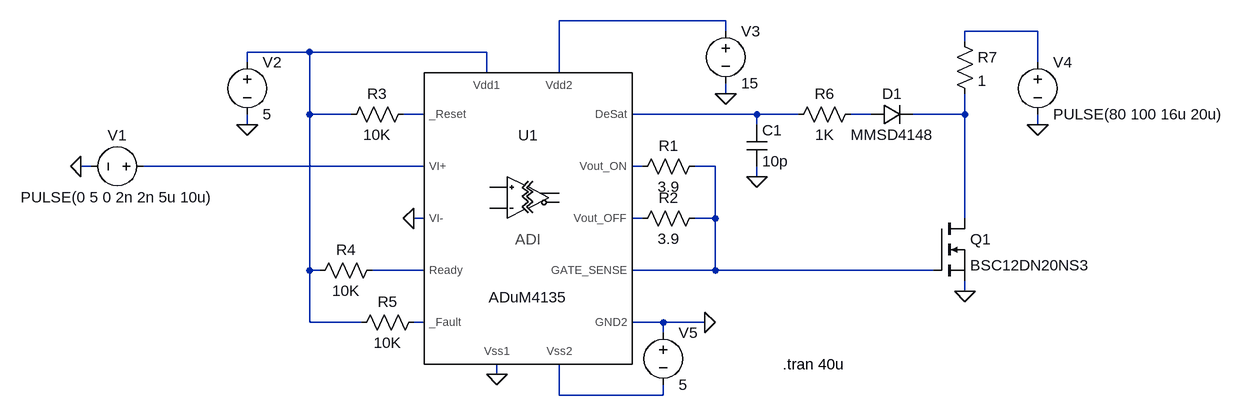
[diagram p0: schematic ADuM4135.asc]
ADuM4135.asc, the LTspice schematic file:
Version 4
SHEET 1 1640 680
WIRE 560 -192 304 -192
WIRE 560 -176 560 -192
WIRE 1040 -176 928 -176
WIRE 928 -160 928 -176
WIRE -80 -144 -176 -144
WIRE 192 -144 -80 -144
WIRE -176 -128 -176 -144
WIRE 1040 -128 1040 -176
WIRE 192 -112 192 -144
WIRE 304 -112 304 -192
WIRE 560 -80 560 -96
WIRE -80 -48 -80 -144
WIRE -16 -48 -80 -48
WIRE 96 -48 64 -48
WIRE 608 -48 416 -48
WIRE 672 -48 608 -48
WIRE 784 -48 752 -48
WIRE 928 -48 928 -80
WIRE 928 -48 848 -48
WIRE -176 -32 -176 -48
WIRE 608 -32 608 -48
WIRE 1040 -32 1040 -48
WIRE -416 32 -432 32
WIRE 96 32 -336 32
WIRE 432 32 416 32
WIRE 544 32 512 32
WIRE 608 48 608 32
WIRE 96 112 80 112
WIRE 432 112 416 112
WIRE 544 112 544 32
WIRE 544 112 512 112
WIRE 928 112 928 -48
WIRE -80 192 -80 -48
WIRE -64 192 -80 192
WIRE 96 192 16 192
WIRE 544 192 544 112
WIRE 544 192 416 192
WIRE 880 192 544 192
WIRE 928 224 928 208
WIRE -80 272 -80 192
WIRE 0 272 -80 272
WIRE 96 272 80 272
WIRE 464 272 416 272
WIRE 528 272 464 272
WIRE 464 288 464 272
WIRE 208 352 208 336
WIRE 304 384 304 336
WIRE 464 384 464 368
WIRE 464 384 304 384
FLAG 608 48 0
FLAG 208 352 0
FLAG 80 112 0
FLAG -432 32 0
FLAG -176 -32 0
FLAG 528 272 0
FLAG 928 224 0
FLAG 560 -80 0
FLAG 1040 -32 0
SYMBOL res 416 48 R270
WINDOW 0 32 56 VTop 2
WINDOW 3 0 56 VBottom 2
SYMATTR InstName R1
SYMATTR Value 3.9
SYMBOL res 416 128 R270
WINDOW 0 32 56 VTop 2
WINDOW 3 0 56 VBottom 2
SYMATTR InstName R2
SYMATTR Value 3.9
SYMBOL res 80 -64 R90
WINDOW 0 0 56 VBottom 2
WINDOW 3 32 56 VTop 2
SYMATTR InstName R3
SYMATTR Value 10K
SYMBOL res 32 176 R90
WINDOW 0 0 56 VBottom 2
WINDOW 3 32 56 VTop 2
SYMATTR InstName R4
SYMATTR Value 10K
SYMBOL res 96 256 R90
WINDOW 0 0 56 VBottom 2
WINDOW 3 32 56 VTop 2
SYMATTR InstName R5
SYMATTR Value 10K
SYMBOL diode 784 -64 M90
WINDOW 0 0 32 VBottom 2
WINDOW 3 32 32 VTop 2
SYMATTR InstName D1
SYMATTR Value MMSD4148
SYMBOL res 768 -64 R90
WINDOW 0 0 56 VBottom 2
WINDOW 3 32 56 VTop 2
SYMATTR InstName R6
SYMATTR Value 1K
SYMBOL cap 592 -32 R0
SYMATTR InstName C1
SYMATTR Value 10p
SYMBOL voltage -320 32 R90
WINDOW 3 32 56 VTop 2
WINDOW 123 74 56 VTop 2
WINDOW 39 53 56 VTop 2
WINDOW 0 -32 56 VBottom 2
SYMATTR Value PULSE(0 5 0 2n 2n 5u 10u)
SYMATTR InstName V1
SYMBOL voltage -176 -144 R0
WINDOW 123 0 0 Left 0
WINDOW 39 0 0 Left 0
SYMATTR InstName V2
SYMATTR Value 5
SYMBOL voltage 560 -192 R0
WINDOW 123 24 138 Left 2
WINDOW 39 24 117 Left 2
SYMATTR InstName V3
SYMATTR Value 15
SYMBOL voltage 1040 -144 R0
WINDOW 123 0 0 Left 0
WINDOW 39 0 0 Left 0
SYMATTR InstName V4
SYMATTR Value PULSE(80 100 16u 20u)
SYMBOL nmos 880 112 R0
SYMATTR InstName Q1
SYMATTR Value BSC12DN20NS3
SYMBOL res 912 -176 R0
SYMATTR InstName R7
SYMATTR Value 1
SYMBOL voltage 464 272 R0
WINDOW 123 24 138 Left 2
WINDOW 39 24 117 Left 2
SYMATTR InstName V5
SYMATTR Value 5
SYMBOL ADUm4135 256 32 R0
SYMATTR InstName U1
TEXT 648 336 Left 2 !.tran 40u

The netlist it stands for:
* ADuM4135.asc
R1 N009 N010 3.9
R2 N011 N010 3.9
R3 N004 N003 10K
R4 N012 N003 10K
R5 N013 N003 10K
D1 N006 N007 MMSD4148
R6 N006 N005 1K
C1 N005 0 10p
V1 N008 0 PULSE(0 5 0 2n 2n 5u 10u)
V2 N003 0 5
V3 N001 0 15
V4 N002 0 PULSE(80 100 16u 20u)
M§Q1 N007 N010 0 0 BSC12DN20NS3
R7 N002 N007 1
V5 0 N014 5
XU1 0 N008 0 N012 N013 N004 N003 N014 N005 0 N011 N001 N009 N010 ADuM4135  ; pins Vss1 VI+ VI- Ready _Fault _Reset Vdd1 Vss2 DeSat GND2 Vout_OFF Vdd2 Vout_ON GATE_SENSE
.model D D
.lib standard.dio
.model NMOS NMOS
.model PMOS PMOS
.lib standard.mos
.tran 40u
.lib ADuM4135.sub
.backanno
.end